# EasyEDA Pro project EASYEDA_Project_IOX_77_devboard_CG.epro, schematic Schematic1
Board Name: Board1; Create Date: 2025-11-27; Page Name: P1; Project Name: ESP BOARD CH32 GPIO; Schematic Name: Schematic1; Update Date: 2025-12-06; Company: EasyEDA.com; Page Size: A4; Version: V1.0
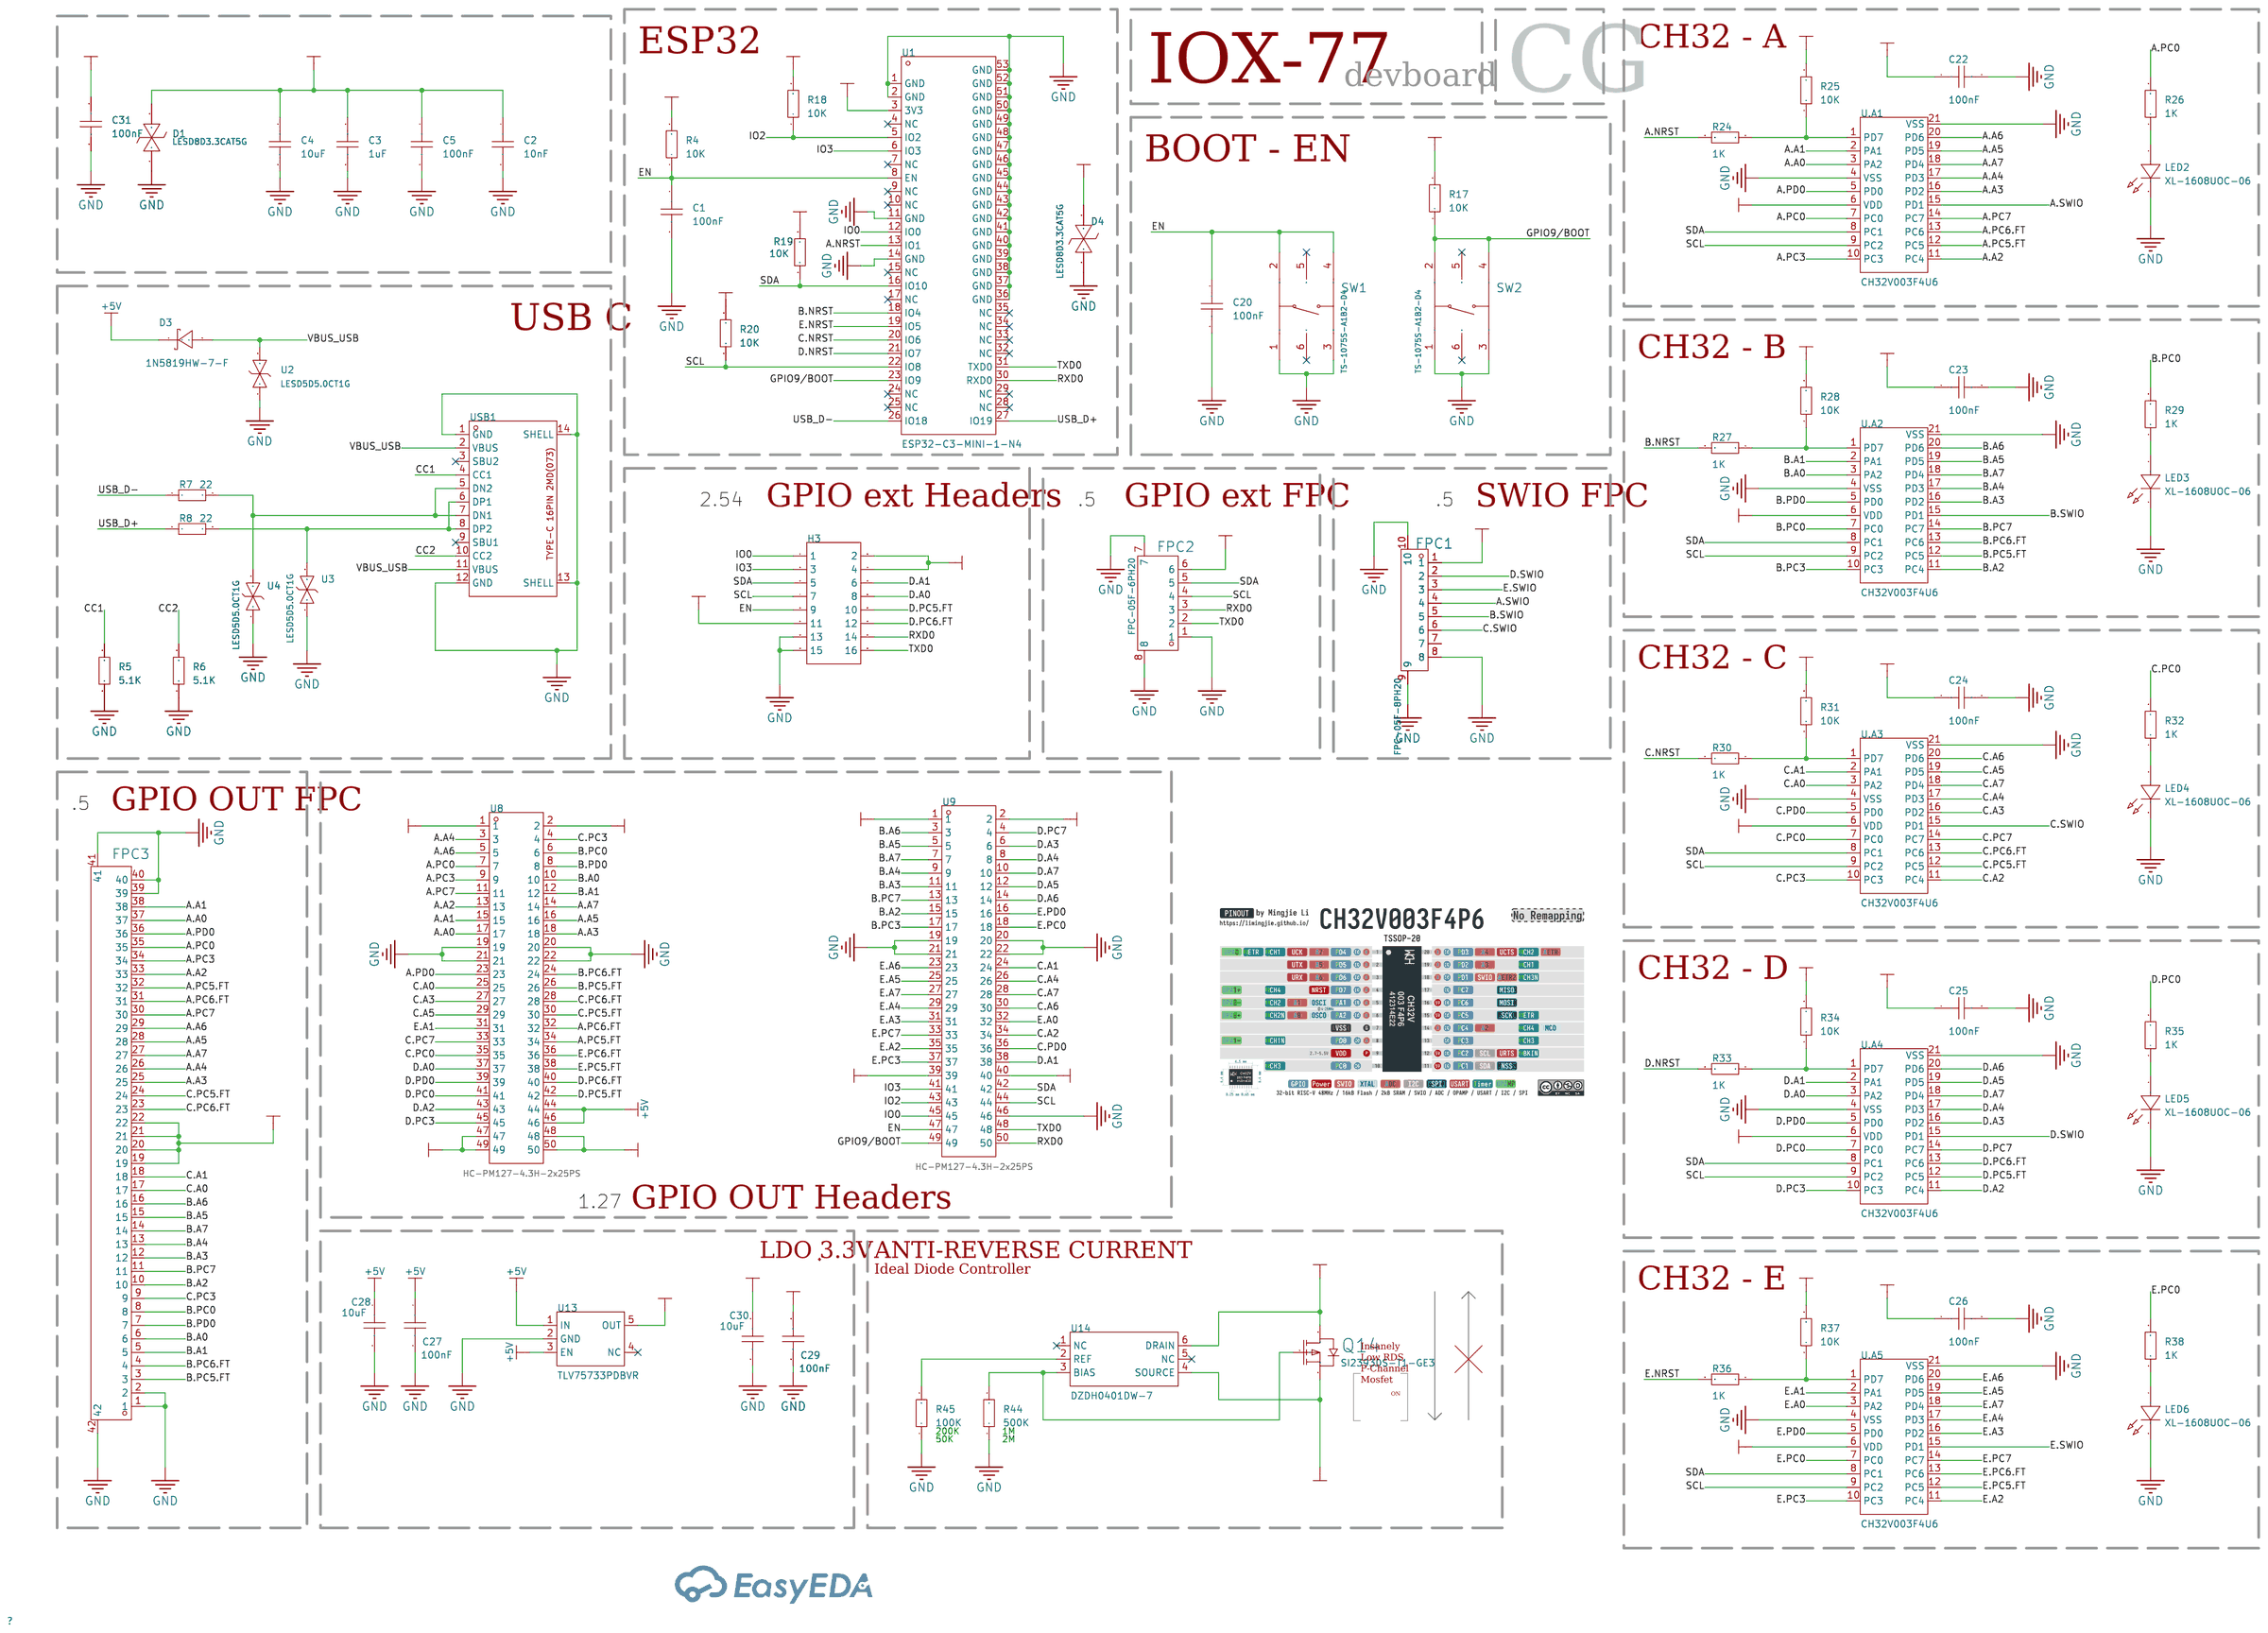
[diagram p0: schematic sheet]

## Parts
C1  100nF  [0603 CAP clean]
C2  10nF  [0603 CAP clean]
C3  1uF  [0603 CAP clean]
C4  10uF  [C0805]
C5  100nF  [0603 CAP clean]
C20  100nF  [0603 CAP clean]
C22  100nF  [0603 CAP clean]
C23  100nF  [0603 CAP clean]
C24  100nF  [0603 CAP clean]
C25  100nF  [0603 CAP clean]
C26  100nF  [0603 CAP clean]
C27  100nF  [0603 CAP clean]
C28  10uF  [C0805]
C29  100nF  [0603 CAP clean]
C30  10uF  [C0805]
C31  100nF  [0603 CAP clean]
D1  LESD8D3.3CAT5G  [SOD-882_L1.0-W0.6-BI]
D3  1N5819HW-7-F  [SOD-123_L2.7-W1.6-LS3.7-RD]
D4  LESD8D3.3CAT5G  [SOD-882_L1.0-W0.6-BI]
FPC1  FPC-05F-8PH20  [FPC-SMD_8P-P0.50_FPC-05F-8PH20]
FPC2  FPC-05F-6PH20  [FPC-SMD_6P-P0.50_XUNPU_FPC-05F-6PH20]
FPC3  FPC-05F-40PH20  [FPC-SMD_40P-P0.50_FPC-05F-40PH20]
H3  -  [ESPIO 2x8 clean]
LED2  XL-1608UOC-06  [ESPIO 0603 LED clean]
LED3  XL-1608UOC-06  [ESPIO 0603 LED clean]
LED4  XL-1608UOC-06  [ESPIO 0603 LED clean]
LED5  XL-1608UOC-06  [ESPIO 0603 LED clean]
LED6  XL-1608UOC-06  [ESPIO 0603 LED clean]
Q14  SI2393DS-T1-GE3  [SOT-23-3_L2.9-W1.3-P1.90-LS2.4-BR]
R4  10K  [R0402]
R5  5.1K  [R0402]
R6  5.1K  [R0402]
R7  22  [R0402]
R8  22  [R0402]
R17  10K  [R0402]
R18  10K  [R0402]
R19  10K  [R0402]
R20  10K  [R0402]
R24  1K  [R0402]
R25  10K  [R0402]
R26  1K  [R0402]
R27  1K  [R0402]
R28  10K  [R0402]
R29  1K  [R0402]
R30  1K  [R0402]
R31  10K  [R0402]
R32  1K  [R0402]
R33  1K  [R0402]
R34  10K  [R0402]
R35  1K  [R0402]
R36  1K  [R0402]
R37  10K  [R0402]
R38  1K  [R0402]
R44  500K  [R0402]
R45  100K  [R0402]
SW1  TS-1075S-A1B2-D4  [SW-SMD_4P-L3.1-W3.1-P2.20-LS4.0]
SW2  TS-1075S-A1B2-D4  [SW-SMD_4P-L3.1-W3.1-P2.20-LS4.0]
U1  ESP32-C3-MINI-1-N4  [WIFIM-SMD_ESP32-C3-MINI-1]
U2  LESD5D5.0CT1G  [SOD-523_L1.2-W0.8-LS1.6-BI]
U3  LESD5D5.0CT1G  [SOD-523_L1.2-W0.8-LS1.6-BI]
U4  LESD5D5.0CT1G  [SOD-523_L1.2-W0.8-LS1.6-BI]
U8  HC-PM127-4.3H-2x25PS  [HDR-SMD_50P-P1.27-V-F-R2-C25-LS4.8]
U9  HC-PM127-4.3H-2x25PS  [HDR-SMD_50P-P1.27-V-F-R2-C25-LS4.8]
U13  TLV75733PDBVR  [SOT-23-5_L2.9-W1.6-P0.95-LS2.8-BL]
U14  DZDH0401DW-7  [SOT-363_L2.0-W1.3-P0.65-LS2.1-BR]
U.A1  CH32V003F4U6  [QFN-20_L3.0-W3.0-P0.40-TL-EP1.7]
U.A2  CH32V003F4U6  [QFN-20_L3.0-W3.0-P0.40-TL-EP1.7]
U.A3  CH32V003F4U6  [QFN-20_L3.0-W3.0-P0.40-TL-EP1.7]
U.A4  CH32V003F4U6  [QFN-20_L3.0-W3.0-P0.40-TL-EP1.7]
U.A5  CH32V003F4U6  [QFN-20_L3.0-W3.0-P0.40-TL-EP1.7]
USB1  TYPE-C 16PIN 2MD(073)  [USB-C-SMD_TYPE-C-6PIN-2MD-073]

## Library data of the parts
C1 = CAP_0603: Supplier Footprint: 0603
C2 C31 = CC0603KRX7R7BB103: Capacitance:10nF Tolerance:±10% Tolerance:±10% Voltage Rating:16V Temperature Coefficient:X7R; LCSC Part Name: 10nF ±10% 16V; Supplier Part: C519406; Manufacturer: YAGEO(国巨); Supplier Footprint: 0603; JLCPCB Part Class: Extended Part; Datasheet: https://item.szlcsc.com/datasheet/CC0603KRX7R7BB103/536077.html; Supplier: LCSC; Tolerance: ±10%; Voltage Rating: 16V; Temperature Coefficient: X7R
C3 = CL10A105KO8NNNC: Capacitance:1uF Tolerance:±10% Tolerance:±10% Voltage Rating:16V Temperature Coefficient:X5R; LCSC Part Name: 1uF ±10% 16V; Supplier Part: C1592; Manufacturer: SAMSUNG(三星); Supplier Footprint: 0603; JLCPCB Part Class: Extended Part; Datasheet: https://item.szlcsc.com/datasheet/CL10A105KO8NNNC/1944.html; Supplier: LCSC; Tolerance: ±10%; Voltage Rating: 16V; Temperature Coefficient: X5R
C4 C28 C30 = CL21A106KOQNNNE: Capacitance:10uF Tolerance:±10% Tolerance:±10% Voltage Rating:16V Temperature Coefficient:X5R; LCSC Part Name: 10uF ±10% 16V; Supplier Part: C1713; Manufacturer: SAMSUNG(三星); Supplier Footprint: 0805; JLCPCB Part Class: Extended Part; Datasheet: https://item.szlcsc.com/datasheet/CL21A106KOQNNNE/2065.html; Supplier: LCSC; Tolerance: ±10%; Voltage Rating: 16V; Temperature Coefficient: X5R
C5 C20 C22-C27 C29 = CL10B104KO8NNNC: Capacitance:100nF Tolerance:±10% Tolerance:±10% Voltage Rating:16V Temperature Coefficient:X7R; LCSC Part Name: 100nF ±10% 16V; Supplier Part: C66501; Manufacturer: SAMSUNG(三星); Supplier Footprint: 0603; JLCPCB Part Class: Extended Part; Datasheet: https://item.szlcsc.com/datasheet/CL10B104KO8NNNC/67585.html; Supplier: LCSC; Tolerance: ±10%; Voltage Rating: 16V; Temperature Coefficient: X7R
D1 D4 = LESD8D3.3CAT5G_C5563754: Polarity:Bidirectional Reverse Stand-Off Voltage (Vrwm):3.3V Clamping Voltage:10V Peak Pulse Current (Ipp):10A Peak Pulse Power Dissipation (Ppp):100W Voltage - Breakdown:3.7V Reverse Leakage Current (Ir):100nA Number of Channels:1 Operating Temperature:-; LCSC Part Name: 双向ESD 3.3V截止 峰值脉冲电流：10A; Supplier Part: C5563754; Manufacturer: FUXINSEMI(富芯森美); Supplier Footprint: SOD-882; JLCPCB Part Class: Extended Part; Datasheet: https://item.szlcsc.com/datasheet/LESD8D3.3CAT5G/6481328.html; Supplier: LCSC; Polarity: Bidirectional; Reverse Stand-Off Voltage (Vrwm): 3.3V; Clamping Voltage: 10V; Peak Pulse Current (Ipp): 10A; Peak Pulse Power Dissipation (Ppp): 100W; Voltage - Breakdown: 3.7V; Reverse Leakage Current (Ir): 100nA; Number of Channels: 1; Operating Temperature: -55℃~+125℃; level of protection: IEC 61000-4-5；IEC 61000-4-2; Type: ESD; Junction Capacitance: 15pF
D3 = 1N5819HW-7-F: Diode Configuration:1 Independent Voltage - Forward(Vf@If):450mV@1A Voltage - DC Reverse(Vr):40V Current - Rectified:1A Reverse Leakage Current (Ir):1mA@40V Operating Junction Temperature Range:-65℃~+150℃ Operating Junction Temperature Range:-65℃~+150℃ No; LCSC Part Name: 电压:40V 电流:1A; Supplier Part: C82544; Manufacturer: DIODES(美台); Supplier Footprint: SOD-123; JLCPCB Part Class: Extended Part; Datasheet: https://item.szlcsc.com/datasheet/1N5819HW-7-F/83701.html; Supplier: LCSC; Diode Configuration: 1 Independent; Voltage - Forward(Vf@If): 450mV@1A; Voltage - DC Reverse(Vr): 40V; Current - Rectified: 1A; Reverse Leakage Current (Ir): 1mA@40V; Operating Junction Temperature Range: -65℃~+150℃; Non-Repetitive Peak Forward Surge Current: 25A
FPC1 = FPC-05F-8PH20: Locking Feature:Hinged Lid Contact Type:Surface Mount Number of Contacts:8P Pitch:0.5mm Mounting Type:Bottom Contact FFC, FCB Thickness:0.3mm FFC, FCB Thickness:0.3mm Height Above Board:2mm Contact Material:Phosphor Bronze Contact Plating:Tin Operating Te; LCSC Part Name: 翻盖式 卧贴 P数:8P 间距:0.5mm; Supplier Part: C2856797; Manufacturer: XUNPU(讯普); Supplier Footprint: SMD,P=0.5mm,卧贴; JLCPCB Part Class: Extended Part; Datasheet: https://item.szlcsc.com/datasheet/FPC-05F-8PH20/3056895.html; Supplier: LCSC; Locking Feature: Hinged Lid; Contact Type: Surface Mount; Number of Contacts: 8P; Pitch: 0.5mm; Mounting Type: Bottom Contact; FFC, FCB Thickness: 0.3mm; Height Above Board: 2mm; Contact Material: Phosphor Bronze; Contact Plating: Tin; Operating Temperature: -25℃~+85℃; Rated Voltage (Max): 50V; Current Rating (Max): 500mA
FPC2 = FPC-05F-6PH20: Locking Feature:Hinged Lid Contact Type:Surface Mount Number of Contacts:6P Pitch:0.5mm Mounting Type:Bottom Contact FFC, FCB Thickness:0.3mm FFC, FCB Thickness:0.3mm Height Above Board:2mm Contact Material:Phosphor Bronze Contact Plating:Tin Operating Te; LCSC Part Name: 翻盖式 卧贴 P数:6P 间距:0.5mm; Supplier Part: C2856796; Manufacturer: XUNPU(讯普); Supplier Footprint: SMD,P=0.5mm,卧贴; JLCPCB Part Class: Extended Part; Datasheet: https://item.szlcsc.com/datasheet/FPC-05F-6PH20/3056894.html; Supplier: LCSC; Locking Feature: Hinged Lid; Contact Type: Surface Mount; Number of Contacts: 6P; Pitch: 0.5mm; Mounting Type: Bottom Contact; FFC, FCB Thickness: 0.3mm; Height Above Board: 2mm; Contact Material: Phosphor Bronze; Contact Plating: Tin; Operating Temperature: -25℃~+85℃; Rated Voltage (Max): 50V; Current Rating (Max): 500mA
FPC3 = FPC-05F-40PH20: Locking Feature:Hinged Lid Contact Type:Surface Mount Number of Contacts:40P Pitch:0.5mm Mounting Type:Bottom Contact FFC, FCB Thickness:0.3mm FFC, FCB Thickness:0.3mm Height Above Board:2mm Contact Material:Phosphor Bronze Contact Plating:Tin Operating T; LCSC Part Name: 翻盖式 卧贴 P数:40P 间距:0.5mm; Supplier Part: C2856812; Manufacturer: XUNPU(讯普); Supplier Footprint: SMD,P=0.5mm,卧贴; JLCPCB Part Class: Extended Part; Datasheet: https://item.szlcsc.com/datasheet/FPC-05F-40PH20/3056910.html; Supplier: LCSC; Locking Feature: Hinged Lid; Contact Type: Surface Mount; Number of Contacts: 40P; Pitch: 0.5mm; Mounting Type: Bottom Contact; FFC, FCB Thickness: 0.3mm; Height Above Board: 2mm; Contact Material: Phosphor Bronze; Contact Plating: Tin; Operating Temperature: -25℃~+85℃; Rated Voltage (Max): 50V; Current Rating (Max): 500mA
H3 = HDR-M_2.54_2x8: Supplier Footprint: Through
LED2-LED6 = XL-1608UOC-06: Illumination Color:Orange Voltage - Forward(Vf):2.3V Voltage - Forward(Vf):2.3V Power(Watts):50mW Forward Current:20mA Wavelength - Dominant:600nm~610nm Wavelength - Dominant:600nm~610nm Peak Wavelength:605nm Lens Color:Colorless Transparent Lens Color Te; Supplier Part: C965800; Manufacturer: XINGLIGHT(成兴光); Supplier Footprint: 0603; JLCPCB Part Class: Extended Part; Datasheet: https://item.szlcsc.com/datasheet/XL-1608UOC-06/1051409.html; Supplier: LCSC; Illumination Color: Orange; Voltage - Forward(Vf): 2.3V; Power(Watts): 50mW; Forward Current: 20mA; Wavelength - Dominant: 600nm~610nm; Peak Wavelength: 605nm; Lens Color: Colorless Transparent Lens; Luminous Intensity: 315mcd; Viewing Angle: 120°; Mounting Sytle: Positive Stick; Operating Temperature: -20℃~+85℃
Q14 = SI2393DS-T1-GE3: Type:1 Piece P-Channel Drain Source Voltage (Vdss): Continuous Drain Current (Id): Drain Source On Resistance (RDS(on)@Vgs,Id):0.0227Ω@10V,7.5A Power Dissipation (Pd): Gate Threshold Voltage (Vgs(th)@Id):1V@250uA Total Gate Charge (Qg@Vgs):8.2nC@10V Input; LCSC Part Name: 1个P沟道 耐压:30V 电流:7.5A; Supplier Part: C5273032; Manufacturer: VISHAY(威世); Supplier Footprint: SOT-23; JLCPCB Part Class: Extended Part; Datasheet: https://atta.szlcsc.com/upload/public/pdf/source/20221117/E8EE1C4AA928E6B0F167573343484F22.pdf; Supplier: LCSC; Type: 1 Piece P-Channel; Drain Source On Resistance (RDS(on)@Vgs,Id): 0.0227Ω@10V,7.5A; Gate Threshold Voltage (Vgs(th)@Id): 1V@250uA; Total Gate Charge (Qg@Vgs): 8.2nC@10V; Input Capacitance (Ciss@Vds): 980pF@15V; Reverse Transfer Capacitance (Crss@Vds): 55pF@15V; Operating Temperature: -55℃~+150℃
R4-R8 R17-R20 R24-R38 R44 R45 = Res_0402: Supplier Footprint: 0402
SW1 SW2 = TS-1075S-A1B2-D4: Circuit:SPST Actuator Style:Round Button Operating Force:1.8N Mounting Type:- Length:3.1mm Width:3.1mm Switch Height:1.5mm With Lamp:- Life:-; LCSC Part Name: 轻触开关3.0*3.0*1.5mm黑柄正按四脚贴片180gf; Supplier Part: C492872; Manufacturer: Yuandi(元迪); JLCPCB Part Class: Extended Part; Datasheet: https://item.szlcsc.com/datasheet/TS-1075S-A1B2-D4/503552.html; Supplier: LCSC; Circuit: SPST; Actuator Style: Round Button; Operating Force: 1.8N; Length: 3.1mm; Width: 3.1mm; Switch Height: 1.5mm
U1 = ESP32-C3-MINI-1-N4: Supplier Part: C2838502; Manufacturer: ESPRESSIF(乐鑫); Supplier Footprint: SMD,13.2x16.6mm; JLCPCB Part Class: Extended Part; Datasheet: https://item.szlcsc.com/datasheet/ESP32-C3-MINI-1-N4/3013227.html; Supplier: LCSC
U2-U4 = LESD5D5.0CT1G_C7433850: Polarity:- Reverse Stand-Off Voltage (Vrwm):5V Clamping Voltage:15V Peak Pulse Current (Ipp):5A Peak Pulse Power Dissipation (Ppp):75W Voltage - Breakdown:9V Reverse Leakage Current (Ir):1uA Number of Channels:1.0 Operating Temperature:-40℃~+150℃ Operatin; Supplier Part: C7433850; Manufacturer: KUU; Supplier Footprint: SOD-523; JLCPCB Part Class: Extended Part; Datasheet: https://item.szlcsc.com/datasheet/LESD5D5.0CT1G/8442902.html; Supplier: LCSC; Reverse Stand-Off Voltage (Vrwm): 5V; Clamping Voltage: 15V; Peak Pulse Current (Ipp): 5A; Peak Pulse Power Dissipation (Ppp): 75W; Voltage - Breakdown: 9V; Reverse Leakage Current (Ir): 1uA; Number of Channels: 1.0; Operating Temperature: -40℃~+150℃; level of protection: IEC 61000-4-2；IEC 61000-4-4; Type: ESD; Junction Capacitance: 15pF
U8 U9 = HC-PM127-4.3H-2x25PS: Holes Structure:2x25P Pitch:1.27mm Row Spacing:1.27mm Circular Hole / Square Hole:Square Hole Mounting Type:Surface Mount,Vertical Number of Rows:2 Number of Positions:50P Current Rating:1A Voltage Rating (Max):- Holes Direction:Top Insulation Height:4.3m; LCSC Part Name: 间距1.27mm 2x25Pin 立贴 PC4.8 PB4.6 H4.3; Supplier Part: C27985226; Manufacturer: HC(虹成电子); Supplier Footprint: SMD,P=1.27mm; JLCPCB Part Class: Extended Part; Datasheet: https://item.szlcsc.com/datasheet/HC-PM127-4.3H-2x25PS/29721184.html; Supplier: LCSC; Holes Structure: 2x25P; Pitch: 1.27mm; Row Spacing: 1.27mm; Circular Hole / Square Hole: Square Hole; Mounting Type: Surface Mount,Vertical; Number of Rows: 2; Number of Positions: 50P; Current Rating: 1A; Holes Direction: Top; Insulation Height: 4.3mm; Contact Material: Phosphor Bronze; Contact Plating: Gold; Operating Temperature: -40℃~+105℃
U13 = TLV75733PDBVR: Output Type:Fixed Voltage - Supply:5.5V Output Voltage:3.3V Output Voltage:3.3V Output Current:1A Power Supply Rejection Ratio (PSRR):46dB@(100kHz) Voltage Dropout:650mV@(1A) standby current:40uA Noise:71.5uVrms Features:Under Voltage Lockout；Soft Start；O; LCSC Part Name: 具有使能功能的 1A、低 IQ、高精度、低压降稳压器; Supplier Part: C485517; Manufacturer: TI(德州仪器); Supplier Footprint: SOT-23-5; JLCPCB Part Class: Extended Part; Datasheet: https://www.ti.com/cn/lit/gpn/tlv757p; Supplier: LCSC; Output Type: Fixed; Voltage - Supply: 5.5V; Output Voltage: 3.3V; Output Current: 1A; Power Supply Rejection Ratio (PSRR): 46dB@(100kHz); Voltage Dropout: 650mV@(1A); standby current: 40uA; Noise: 71.5uVrms; Features: Under Voltage Lockout；Soft Start；Over Temperature Protection；Over Current Protection; Operating Temperature: -40℃~+125℃@(Tj); Output Configuration: Positive; Number of Outputs: 1
U14 = DZDH0401DW-7: Output Current:3A Input Voltage:40V Input Voltage:40V Operating Temperature	-:-65℃~+150℃ Operating Temperature	-:-65℃~+150℃; Supplier Part: C3235552; Manufacturer: DIODES(美台); Supplier Footprint: SOT-363; JLCPCB Part Class: Extended Part; Datasheet: https://atta.szlcsc.com/upload/public/pdf/source/20230810/8FED7E1652A4FCB92DBEFD1C5247492A.pdf; Supplier: LCSC; Output Current: 3A; Input Voltage: 40V; Operating Temperature	-: -65℃~+150℃
U.A1-U.A5 = CH32V003F4U6: CPU Core:RISC-V CPU Maximum Speed:48MHz Program Storage Size:16KB Number of I/O:18 Applications:-; LCSC Part Name: QingKe V2微处理器; Supplier Part: C5299908; Manufacturer: WCH(南京沁恒); Supplier Footprint: QFN-20(3X3); JLCPCB Part Class: Extended Part; Datasheet: https://item.szlcsc.com/datasheet/CH32V003F4U6/6049934.html; Supplier: LCSC; CPU Core: RISC-V; CPU Maximum Speed: 48MHz; Program Storage Size: 16KB; Number of I/O: 18
USB1 = TYPE-C 16PIN 2MD(073): Connector Type:Type-C Protocol Standard:- Gender:Female Mounting Type:Surface Mount, Right Angle Number of Contacts:16P Number of Ports:1 Current Rating-Power:3A Voltage Rating:5V Connect-Disconnect Life:5,000 Cycles Supplementary Features:- Center Height; LCSC Part Name: Type-C 母 卧贴; Supplier Part: C2765186; Manufacturer: SHOU HAN(首韩); Supplier Footprint: SMD; JLCPCB Part Class: Extended Part; Datasheet: https://item.szlcsc.com/datasheet/TYPE-C%252016PIN%25202MD(073)/2901843.html; Supplier: LCSC; Connector Type: Type-C; Gender: Female; Mounting Type: Surface Mount, Right Angle; Number of Contacts: 16P; Number of Ports: 1; Current Rating-Power: 3A; Voltage Rating: 5V; Connect-Disconnect Life: 5,000 Cycles; Detection color: Black; Operating Temperature: -25℃~+85℃

## Nets
+3.3V: C2.1 C3.1 C4.1 C5.1 C22.1 C23.1 C24.1 C25.1 C26.1 C31.1 D1.2 D4.2 FPC1.1 FPC2.6 FPC3.19 FPC3.20 FPC3.21 FPC3.22 H3.2 H3.4 Q14.2(S) R4.2 R17.2 R18.2 R19.2 R20.2 R25.2 R28.2 R31.2 R34.2 R37.2 U1.3(3V3) U8.1 U8.2 U8.47 U8.48 U8.49 U8.50 U9.1 U9.2 U9.39 U9.40 U14.4(SOURCE) U.A1.6(VDD) U.A2.6(VDD) U.A3.6(VDD) U.A4.6(VDD) U.A5.6(VDD)
+3.3V.LDO: C29.1 C30.1 Q14.3(D) U13.5(OUT) U14.6(DRAIN)
+5V: C27.1 C28.1 D3.1(K) H3.11 U8.44 U8.46 U13.1(IN) U13.3(EN)
GND: C1.2 C2.2 C3.2 C4.2 C5.2 C20.2 C22.2 C23.2 C24.2 C25.2 C26.2 C27.2 C28.2 C29.2 C30.2 C31.2 D1.1 D4.1 FPC1.8 FPC1.9 FPC1.10 FPC2.1 FPC2.7 FPC2.8 FPC3.1 FPC3.2 FPC3.39 FPC3.40 FPC3.41 FPC3.42 H3.13 H3.15 LED2.2(A) LED3.2(A) LED4.2(A) LED5.2(A) LED6.2(A) R5.1 R6.1 R44.1 R45.1 SW1.1 SW1.3 SW2.1 SW2.3 U1.1(GND) U1.2(GND) U1.11(GND) U1.14(GND) U1.36(GND) U1.37(GND) U1.38(GND) U1.39(GND) U1.40(GND) U1.41(GND) U1.42(GND) U1.43(GND) U1.44(GND) U1.45(GND) U1.46(GND) U1.47(GND) U1.48(GND) U1.49(GND) U1.50(GND) U1.51(GND) U1.52(GND) U1.53(GND) U2.1 U3.1 U4.1 U8.19 U8.20 U8.21 U8.22 U9.19 U9.20 U9.21 U9.22 U9.46 U13.2(GND) U.A1.4(VSS) U.A1.21(VSS) U.A2.4(VSS) U.A2.21(VSS) U.A3.4(VSS) U.A3.21(VSS) U.A4.4(VSS) U.A4.21(VSS) U.A5.4(VSS) U.A5.21(VSS) USB1.1(GND) USB1.12(GND) USB1.13(SHELL) USB1.14(SHELL)
VBUS_USB: D3.2(A) U2.2 USB1.2(VBUS) USB1.11(VBUS)
A.A0: FPC3.37 U8.17 U.A1.3(PA2)
A.A1: FPC3.38 U8.15 U.A1.2(PA1)
A.A2: FPC3.33 U8.13 U.A1.11(PC4)
A.A3: FPC3.25 U8.18 U.A1.16(PD2)
A.A4: FPC3.26 U8.3 U.A1.17(PD3)
A.A5: FPC3.28 U8.16 U.A1.19(PD5)
A.A6: FPC3.29 U8.5 U.A1.20(PD6)
A.A7: FPC3.27 U8.14 U.A1.18(PD4)
A.NRST: R24.2 U1.13(IO1)
A.PC0: FPC3.35 R26.2 U8.7 U.A1.7(PC0)
A.PC3: FPC3.34 U8.9 U.A1.10(PC3)
A.PC5.FT: FPC3.32 U8.34 U.A1.12(PC5)
A.PC6.FT: FPC3.31 U8.32 U.A1.13(PC6)
A.PC7: FPC3.30 U8.11 U.A1.14(PC7)
A.PD0: FPC3.36 U8.23 U.A1.5(PD0)
A.SWIO: FPC1.4 U.A1.15(PD1)
B.A0: FPC3.6 U8.10 U.A2.3(PA2)
B.A1: FPC3.5 U8.12 U.A2.2(PA1)
B.A2: FPC3.10 U9.15 U.A2.11(PC4)
B.A3: FPC3.12 U9.11 U.A2.16(PD2)
B.A4: FPC3.13 U9.9 U.A2.17(PD3)
B.A5: FPC3.15 U9.5 U.A2.19(PD5)
B.A6: FPC3.16 U9.3 U.A2.20(PD6)
B.A7: FPC3.14 U9.7 U.A2.18(PD4)
B.NRST: R27.2 U1.18(IO4)
B.PC0: FPC3.8 R29.2 U8.6 U.A2.7(PC0)
B.PC3: U9.17 U.A2.10(PC3)
B.PC5.FT: FPC3.3 U8.26 U.A2.12(PC5)
B.PC6.FT: FPC3.4 U8.24 U.A2.13(PC6)
B.PC7: FPC3.11 U9.13 U.A2.14(PC7)
B.PD0: FPC3.7 U8.8 U.A2.5(PD0)
B.SWIO: FPC1.5 U.A2.15(PD1)
C.A0: FPC3.17 U8.25 U.A3.3(PA2)
C.A1: FPC3.18 U9.24 U.A3.2(PA1)
C.A2: U9.34 U.A3.11(PC4)
C.A3: U8.27 U.A3.16(PD2)
C.A4: U9.26 U.A3.17(PD3)
C.A5: U8.29 U.A3.19(PD5)
C.A6: U9.30 U.A3.20(PD6)
C.A7: U9.28 U.A3.18(PD4)
C.NRST: R30.2 U1.20(IO6)
C.PC0: R32.2 U8.35 U.A3.7(PC0)
C.PC3: FPC3.9 U8.4 U.A3.10(PC3)
C.PC5.FT: FPC3.24 U8.30 U.A3.12(PC5)
C.PC6.FT: FPC3.23 U8.28 U.A3.13(PC6)
C.PC7: U8.33 U.A3.14(PC7)
C.PD0: U9.36 U.A3.5(PD0)
C.SWIO: FPC1.6 U.A3.15(PD1)
CC1: R5.2 USB1.4(CC1)
CC2: R6.2 USB1.10(CC2)
D.A0: H3.8 U8.37 U.A4.3(PA2)
D.A1: H3.6 U9.38 U.A4.2(PA1)
D.A2: U8.43 U.A4.11(PC4)
D.A3: U9.6 U.A4.16(PD2)
D.A4: U9.8 U.A4.17(PD3)
D.A5: U9.12 U.A4.19(PD5)
D.A6: U9.14 U.A4.20(PD6)
D.A7: U9.10 U.A4.18(PD4)
D.NRST: R33.2 U1.21(IO7)
D.PC0: R35.2 U8.41 U.A4.7(PC0)
D.PC3: U8.45 U.A4.10(PC3)
D.PC5.FT: H3.10 U8.42 U.A4.12(PC5)
D.PC6.FT: H3.12 U8.40 U.A4.13(PC6)
D.PC7: U9.4 U.A4.14(PC7)
D.PD0: U8.39 U.A4.5(PD0)
D.SWIO: FPC1.2 U.A4.15(PD1)
E.A0: U9.32 U.A5.3(PA2)
E.A1: U8.31 U.A5.2(PA1)
E.A2: U9.35 U.A5.11(PC4)
E.A3: U9.31 U.A5.16(PD2)
E.A4: U9.29 U.A5.17(PD3)
E.A5: U9.25 U.A5.19(PD5)
E.A6: U9.23 U.A5.20(PD6)
E.A7: U9.27 U.A5.18(PD4)
E.NRST: R36.2 U1.19(IO5)
E.PC0: R38.2 U9.18 U.A5.7(PC0)
E.PC3: U9.37 U.A5.10(PC3)
E.PC5.FT: U8.38 U.A5.12(PC5)
E.PC6.FT: U8.36 U.A5.13(PC6)
E.PC7: U9.33 U.A5.14(PC7)
E.PD0: U9.16 U.A5.5(PD0)
E.SWIO: FPC1.3 U.A5.15(PD1)
EN: C1.1 C20.1 H3.9 R4.1 SW1.2 SW1.4 U1.8(EN) U9.47
GPIO9/BOOT: R17.1 SW2.2 SW2.4 U1.23(IO9) U9.49
IO0: H3.1 U1.12(IO0) U9.45
IO2: R18.1 U1.5(IO2) U9.43
IO3: H3.3 U1.6(IO3) U9.41
RXD0: FPC2.3 H3.14 U1.30(RXD0) U9.50
SCL: FPC2.4 H3.7 R20.1 U1.22(IO8) U9.44 U.A1.9(PC2) U.A2.9(PC2) U.A3.9(PC2) U.A4.9(PC2) U.A5.9(PC2)
SDA: FPC2.5 H3.5 R19.1 U1.16(IO10) U9.42 U.A1.8(PC1) U.A2.8(PC1) U.A3.8(PC1) U.A4.8(PC1) U.A5.8(PC1)
TXD0: FPC2.2 H3.16 U1.31(TXD0) U9.48
USB_D+: R8.1 U1.27(IO19)
USB_D-: R7.1 U1.26(IO18)
$1N2210: R7.2 U4.2 USB1.5(DN2) USB1.7(DN1)
$1N2216: R8.2 U3.2 USB1.6(DP1) USB1.8(DP2)
$1N5190: R24.1 R25.1 U.A1.1(PD7)
$1N5199: LED2.1(K) R26.1
$1N5603: R27.1 R28.1 U.A2.1(PD7)
$1N5612: LED3.1(K) R29.1
$1N6016: R30.1 R31.1 U.A3.1(PD7)
$1N6025: LED4.1(K) R32.1
$1N6429: R33.1 R34.1 U.A4.1(PD7)
$1N6438: LED5.1(K) R35.1
$1N6842: R36.1 R37.1 U.A5.1(PD7)
$1N6851: LED6.1(K) R38.1
$1N20024: Q14.1(G) R44.2 U14.3(BIAS)
$1N20025: R45.2 U14.2(REF)

Not connected (* = marked no-connect by the designer): FPC1 7; SW1 5* 6*; SW2 5* 6*; U1 4(NC)* 7(NC)* 9(NC)* 10(NC)* 15(NC)* 17(NC)* 24(NC)* 25(NC)* 28(NC)* 29(NC)* 32(NC)* 33(NC)* 34(NC)* 35(NC)*; U13 4(NC)*; U14 1(NC)* 5(NC)*; USB1 3(SBU2)* 9(SBU1)*

## Notes on the sheet
- ESP32
- CH32 - A
- devboard
- IOX-77
- CG
- BOOT - EN
- USB C
- CH32 - B
- 2.54
- .5
- .5
- GPIO ext Headers
- GPIO ext FPC
- SWIO FPC
- CH32 - C
- .5
- GPIO OUT FPC
- CH32 - D
- 1.27
- GPIO OUT Headers
- LDO 3.3V
- .
- ANTI-REVERSE CURRENT
- Ideal Diode Controller
- CH32 - E
- Insanely
  Low RDS
  P-Channel
  Mosfet
- ON
- 200K
- 1M
- 50K
- 2M
